# Altium schematic sheet 接线图.SchDoc
size A4
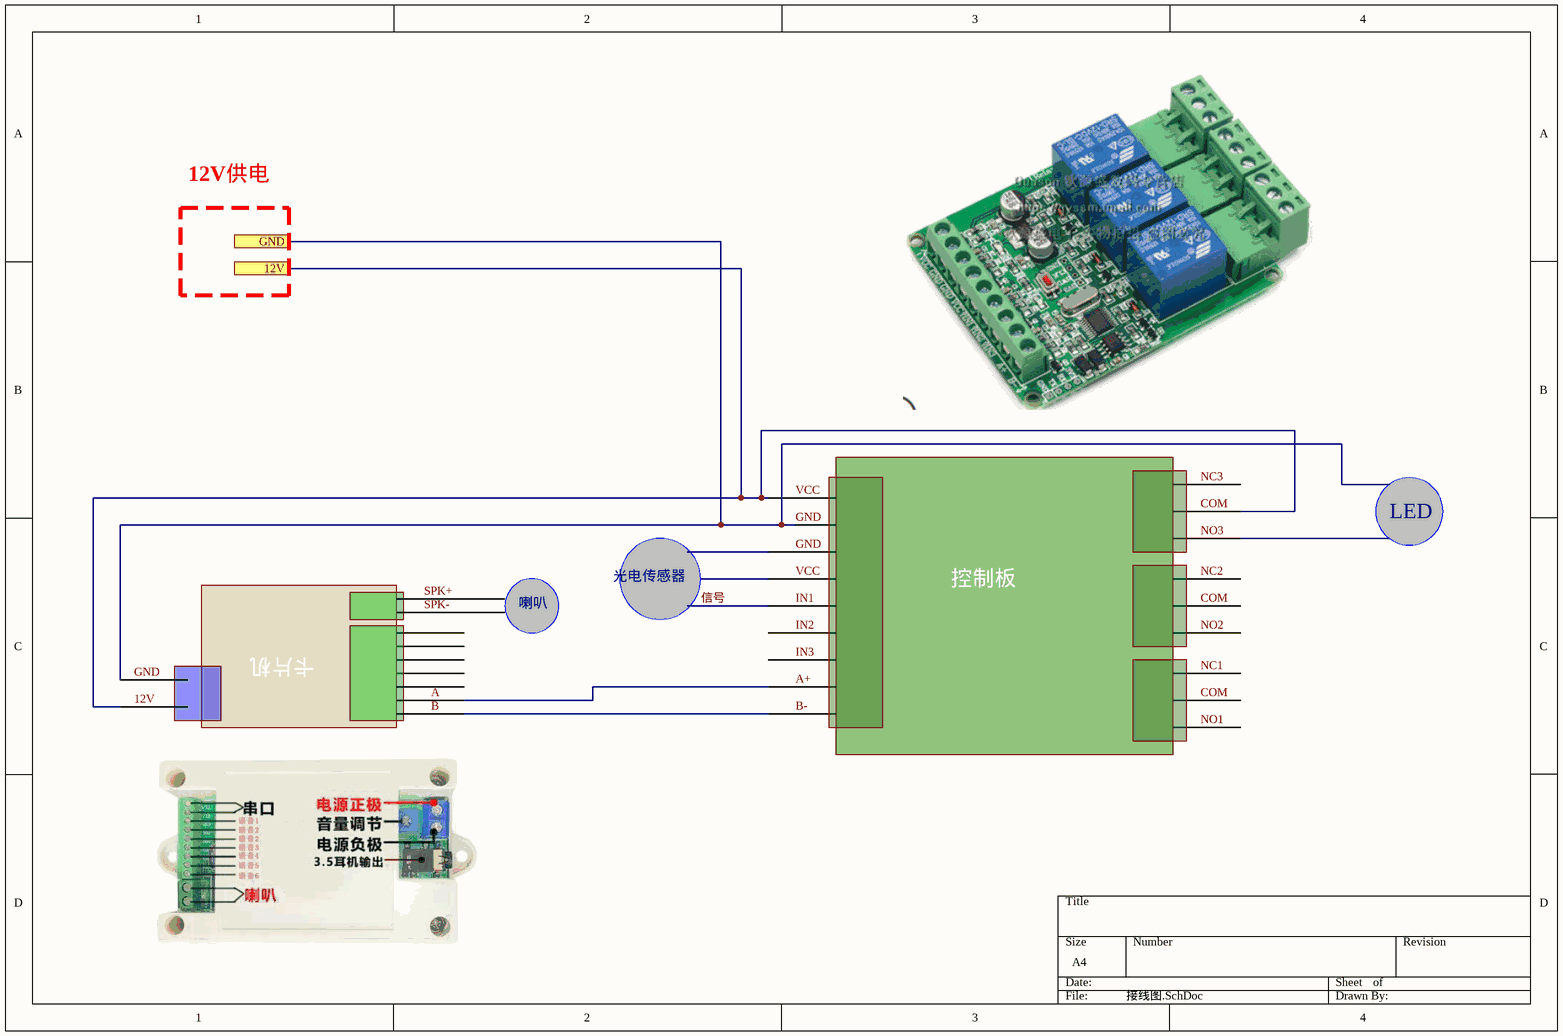
[diagram p0: 接线图.SchDoc]

## Ports
12V, GND

## Nets
GND: port GND

## Notes on the sheet
- 12V供电
- LED
- 光电传感器
- 卡片机
- 喇叭
- 控制板
- Labels drawn without touching a wire or pin: 12V, A, A+, B, B-, COM, GND, IN1, IN2, IN3, NC1, NC2, NC3, NO1, NO2, NO3, SPK+, SPK-, VCC